# Altium project bb_kinetic_harvester.PrjPcb
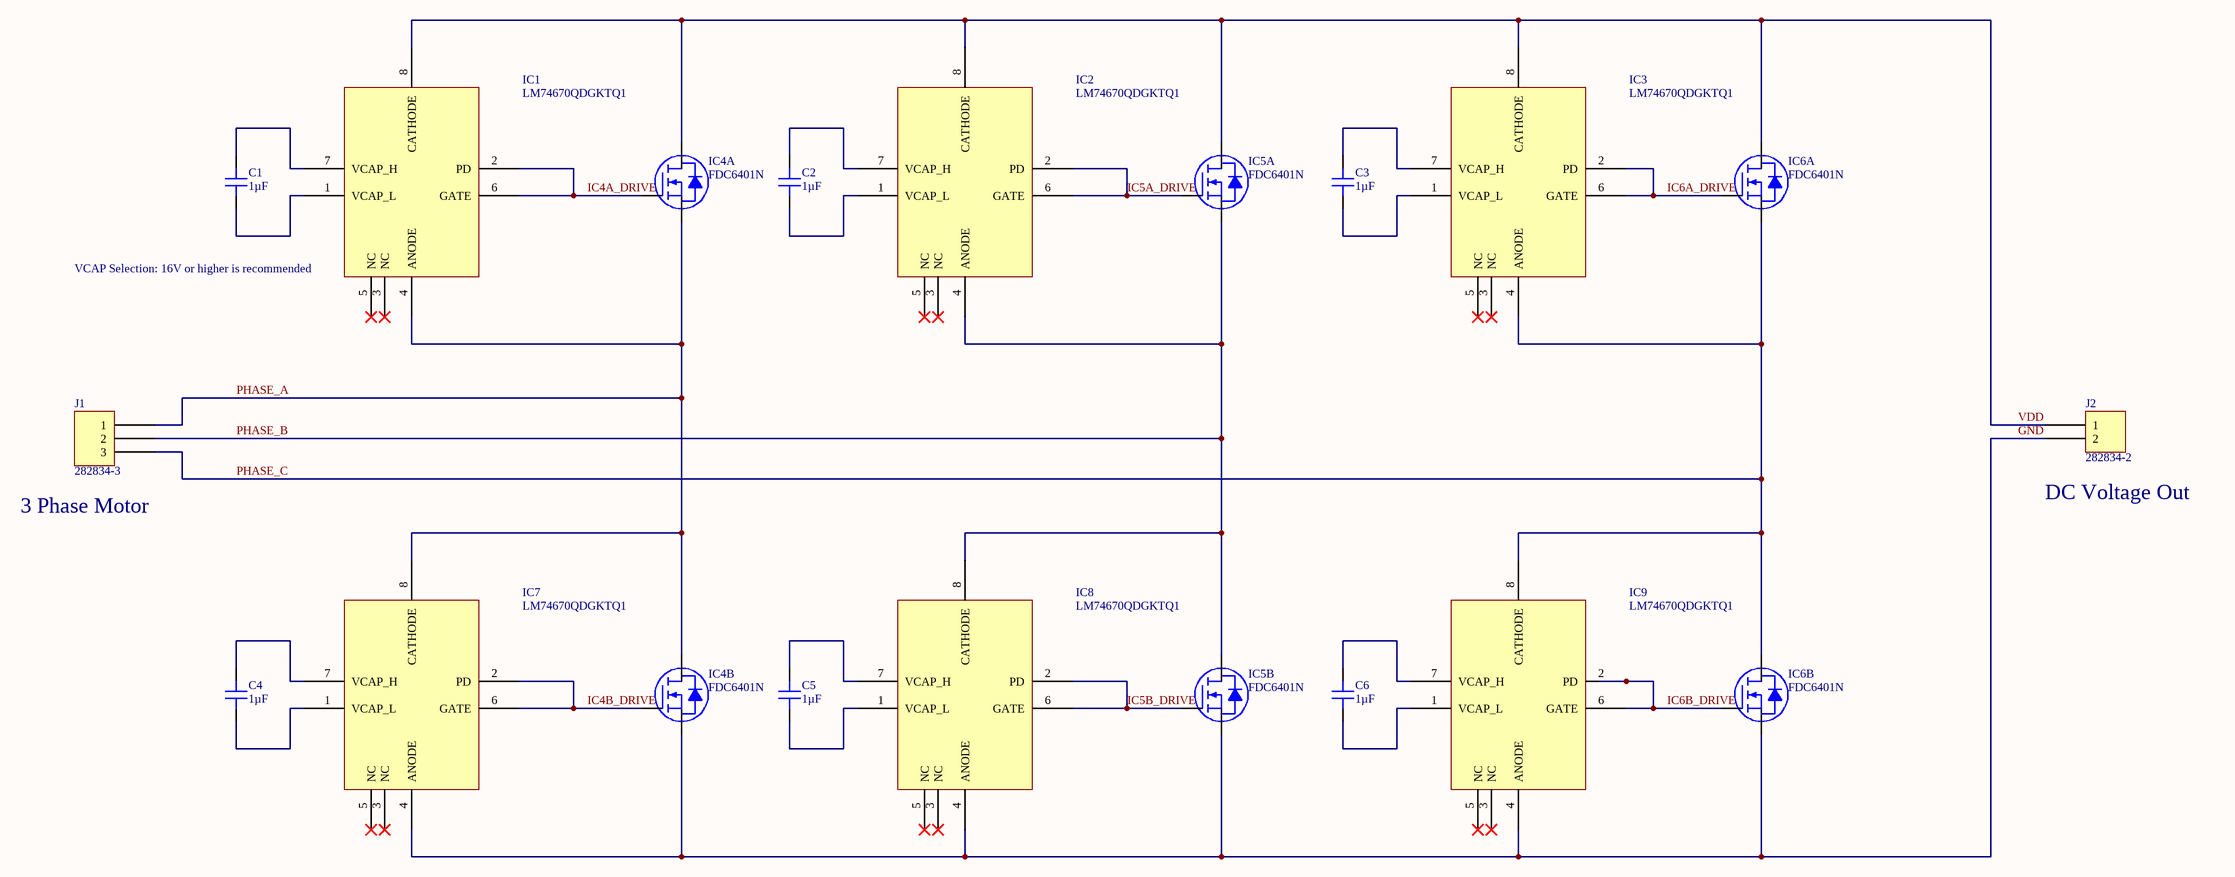
[diagram p0: 1_FullBridge.SchDoc]
1 sheet, 17 parts. Net scope: global (net labels, ports and power ports of the same name join across sheets).

## Sheet 1_FullBridge.SchDoc: 3 Phase Full Bridge Rectifier
size A2; DrawnBy: DG; DocumentNumber: 2; Revision: 0.1; SheetNumber: 2; SheetTotal: 3

### Parts
C1  1µF  [CAP 0805_2012]
C2  1µF  [CAP 0805_2012]
C3  1µF  [CAP 0805_2012]
C4  1µF  [CAP 0805_2012]
C5  1µF  [CAP 0805_2012]
C6  1µF  [CAP 0805_2012]
IC1  LM74670QDGKTQ1  [TI_8VSSOP]
IC2  LM74670QDGKTQ1  [TI_8VSSOP]
IC3  LM74670QDGKTQ1  [TI_8VSSOP]
IC4  FDC6401N  [FAIRCHILD SOT-23-6 SUPERSOT-6]  (parts A,B of 2)
IC5  FDC6401N  [FAIRCHILD SOT-23-6 SUPERSOT-6]  (parts A,B of 2)
IC6  FDC6401N  [FAIRCHILD SOT-23-6 SUPERSOT-6]  (parts A,B of 2)
IC7  LM74670QDGKTQ1  [TI_8VSSOP]
IC8  LM74670QDGKTQ1  [TI_8VSSOP]
IC9  LM74670QDGKTQ1  [TI_8VSSOP]
J1  282834-3  [TE 282834-3]
J2  282834-2  [TE 282834-2]

### Nets
GND: IC4.2(S2) IC5.2(S2) IC6.2(S2) IC7.4(ANODE) IC8.4(ANODE) IC9.4(ANODE) J2.2
IC4A_DRIVE: IC1.2(PD) IC1.6(GATE) IC4.1(G1)
IC4B_DRIVE: IC4.3(G2) IC7.2(PD) IC7.6(GATE)
IC5A_DRIVE: IC2.2(PD) IC2.6(GATE) IC5.1(G1)
IC5B_DRIVE: IC5.3(G2) IC8.2(PD) IC8.6(GATE)
IC6A_DRIVE: IC3.2(PD) IC3.6(GATE) IC6.1(G1)
IC6B_DRIVE: IC6.3(G2) IC9.2(PD) IC9.6(GATE)
PHASE_A: IC1.4(ANODE) IC4.4(D2) IC4.5(S1) IC7.8(CATHODE) J1.1
PHASE_B: IC2.4(ANODE) IC5.4(D2) IC5.5(S1) IC8.8(CATHODE) J1.2
PHASE_C: IC3.4(ANODE) IC6.4(D2) IC6.5(S1) IC9.8(CATHODE) J1.3
VDD: IC1.8(CATHODE) IC2.8(CATHODE) IC3.8(CATHODE) IC4.6(D1) IC5.6(D1) IC6.6(D1) J2.1
NetC1_1: C1.1 IC1.7(VCAP_H)
NetC1_2: C1.2 IC1.1(VCAP_L)
NetC2_1: C2.1 IC2.7(VCAP_H)
NetC2_2: C2.2 IC2.1(VCAP_L)
NetC3_1: C3.1 IC3.7(VCAP_H)
NetC3_2: C3.2 IC3.1(VCAP_L)
NetC4_1: C4.1 IC7.7(VCAP_H)
NetC4_2: C4.2 IC7.1(VCAP_L)
NetC5_1: C5.1 IC8.7(VCAP_H)
NetC5_2: C5.2 IC8.1(VCAP_L)
NetC6_1: C6.1 IC9.7(VCAP_H)
NetC6_2: C6.2 IC9.1(VCAP_L)

Not connected (* = marked no-connect by the designer): IC1 3(NC)* 5(NC)*; IC2 3(NC)* 5(NC)*; IC3 3(NC)* 5(NC)*; IC7 3(NC)* 5(NC)*; IC8 3(NC)* 5(NC)*; IC9 3(NC)* 5(NC)*

### Notes on the sheet
- (near IC1) VCAP Selection: 16V or higher is recommended
- (near J1) 3 Phase Motor
- (near J2) DC Voltage Out
- Title
- Size:
- Date:
- File:
- A2
- Number:
- Time:
- Revision:
- Sheet
- of

### Library data of the parts
C1-C6 = GCM21BR71H105KA03L: CAP CER 1UF 50V X7R 0805; Manufacturer: Murata Electronics; Tolerance: ±10%; Part Number: GCM21BR71H105KA03L; Value: 1µF; Applications: Automotive; Capacitance: 1µF; ComponentLink1Description: Datasheet; ComponentLink1URL: https://www.murata.com/~/media/webrenewal/support/library/catalog/products/capacitor/mlcc/c03e.ashx?la=en-us; ComponentLink2Description: DigiKey Link; ComponentLink2URL: http://digikey.com/product-detail/en/murata-electronics/GCM21BR71H105KA03L/490-10675-1-ND/5251430; Device Package: 0805 (2012 Metric); LastUpdated: 2020-09-02 1:04:41 AM; Lifecycle Status: Active; Minimum Order: 1; Mounting Type: Surface Mount, MLCC; Operating Temperature: -55°C ~ 125°C; Package / Case: 0805 (2012 Metric); Packaging: TapeAndReel; PartId: 2659; Part Status: Active; Price: 0.08; Ratings: AEC-Q200; Series: GCM; Size / Dimension: 0.079" L x 0.049" W (2.00mm x 1.25mm); Supplier 1: DigiKey; Supplier Part Number 1: 490-10675-1-ND; Temperature Coefficient: X7R; Thickness (Max): 0.055" (1.40mm); Voltage - Rated: 50V
IC1-IC3 IC7-IC9 = TI LM74670-Q1: Zero IQ Smart Diode Rectifier Controller; ManufacturerPartNumber: LM74670QDGKTQ1; Supplier 1: Digi-Key
IC4-IC6 = FDC6401N: MOSFET 2N-CH 20V 3A SSOT-6; Manufacturer: ON Semiconductor; FET Feature: Standard; FET Type: 2 N-Channel (Dual); Gate Charge (Qg) (Max) @ Vgs: 4.6nC @ 4.5V; Input Capacitance (Ciss) (Max) @ Vds: 324pF @ 10V; Power - Max: 700mW; Rds On (Max) @ Id, Vgs: 70mOhm @ 3A, 4.5V; Vgs(th) (Max) @ Id: 1.5V @ 250µA; Part Number: FDC6401N; ComponentLink1Description: Datasheet; ComponentLink1URL: https://www.onsemi.com/pub/Collateral/FDC6401N-D.pdf; ComponentLink2Description: DigiKey Link; ComponentLink2URL: http://digikey.com/product-detail/en/on-semiconductor/FDC6401N/FDC6401NCT-ND/1626191; Current - Continuous Drain (Id) @ 25°C: 3A; Drain to Source Voltage (Vdss): 20V; LastUpdated: 2020-09-02 1:30:17 AM; Lifecycle Status: Active; Minimum Order: 1; Mounting Type: Surface Mount; Operating Temperature: -55°C ~ 150°C (TJ); Package / Case: SOT-23-6 Thin, TSOT-23-6; Packaging: TapeAndReel; Part Status: Active; Price: 0.17; Series: PowerTrench®; Supplier 1: DigiKey; Supplier Part Number 1: FDC6401NCT-ND; Supplier Device Package: SuperSOT™-6
J1 = 282834-3: TERM BLK 3P SIDE ENT 2.54MM PCB; Manufacturer: TE Connectivity AMP Connectors; Current: 10A; Mating Orientation: Horizontal with Board; Number of Levels: 1; Pitch: 0.100" (2.54mm); Positions Per Level: 3; Voltage: 150V; Wire Gauge: 16-30 AWG; Wire Termination: Screw - Rising Cage Clamp; Part Number: 282834-3; Color: Green; ComponentLink1Description: Datasheet; ComponentLink1URL: https://www.te.com/commerce/DocumentDelivery/DDEController?Action=srchrtrv&DocNm=282834&DocType=Customer+Drawing&DocLang=English; ComponentLink2Description: DigiKey Link; ComponentLink2URL: http://digikey.com/product-detail/en/te-connectivity-amp-connectors/282834-3/A98334-ND/1153264; LastUpdated: 2020-01-15 4:15:50 AM; Lifecycle Status: Active; Minimum Order: 1; Mounting Type: Through Hole; Packaging: Bulk; Part Status: Active; Price: 2.01; Series: Buchanan; Supplier 1: DigiKey; Supplier Part Number 1: A98334-ND
J2 = 282834-2: TERM BLK 2P SIDE ENT 2.54MM PCB; Manufacturer: TE Connectivity AMP Connectors; Current: 10A; Mating Orientation: Horizontal with Board; Number of Levels: 1; Pitch: 0.100" (2.54mm); Positions Per Level: 2; Voltage: 150V; Wire Gauge: 16-30 AWG; Wire Termination: Screw - Rising Cage Clamp; Part Number: 282834-2; Color: Green; ComponentLink1Description: Datasheet; ComponentLink1URL: https://www.te.com/commerce/DocumentDelivery/DDEController?Action=srchrtrv&DocNm=282834&DocType=Customer+Drawing&DocLang=English; ComponentLink2Description: DigiKey Link; ComponentLink2URL: http://digikey.com/product-detail/en/te-connectivity-amp-connectors/282834-2/A98333-ND/1150135; LastUpdated: 2020-01-15 4:15:38 AM; Lifecycle Status: Active; Minimum Order: 1; Mounting Type: Through Hole; Packaging: Bulk; Part Status: Active; Price: 0.88; Series: Buchanan; Supplier 1: DigiKey; Supplier Part Number 1: A98333-ND